# Altium schematic sheet MIDI_CV_converter.SchDoc: MIDI to CV Converter
size Letter; Organization: Nicholas Morrow; Address1: UC Santa Barbara; Address2: Physics 127AL; Address3: Spring 2015; Revision: a
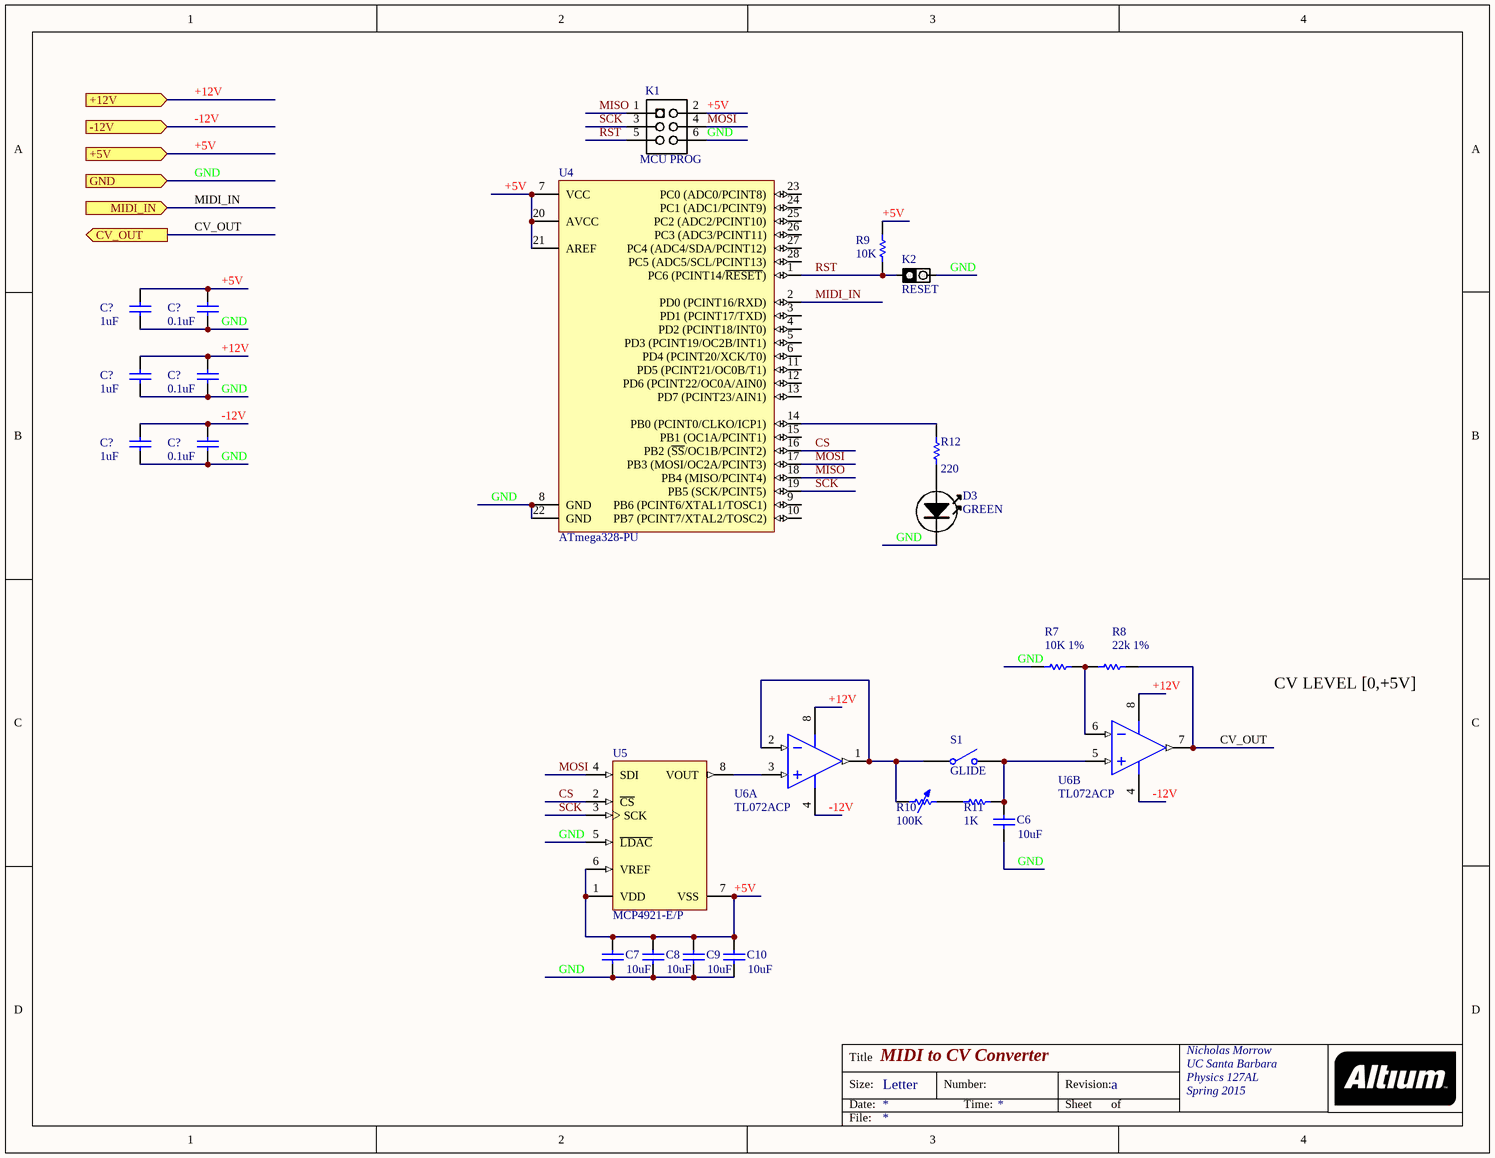
[diagram p0: MIDI_CV_converter.SchDoc]

## Parts
(Parts that share a designator on the sheet are numbered #1, #2 ... from top to bottom, then left to right.)
C6  value 10uF  [RAD-0.3]  (hidden comment: Cap)
C7  value 10uF  [RAD-0.3]  (hidden comment: Cap)
C8  value 10uF  [RAD-0.3]  (hidden comment: Cap)
C9  value 10uF  [RAD-0.3]  (hidden comment: Cap)
C10  value 10uF  [RAD-0.3]  (hidden comment: Cap)
C?#1  value 1uF  [RAD-0.3]  (hidden comment: Cap)
C?#2  value 0.1uF  [RAD-0.3]  (hidden comment: Cap)
C?#3  value 1uF  [RAD-0.3]  (hidden comment: Cap)
C?#4  value 0.1uF  [RAD-0.3]  (hidden comment: Cap)
C?#5  value 1uF  [RAD-0.3]  (hidden comment: Cap)
C?#6  value 0.1uF  [RAD-0.3]  (hidden comment: Cap)
D3  GREEN  [LED-5MM-GREEN]
K1  MCU PROG  [HEADER-2X3]
K2  RESET  [JMPR2]
R7  value 10K 1%  [AXIAL-0.3]
R8  value 22k 1%  [AXIAL-0.3]
R9  value 10K  [AXIAL-0.3]
R10  value 100K  [AXIAL-0.7]  (hidden comment: Res Adj1)
R11  value 1K  [AXIAL-0.3]
R12  value 220  [AXIAL-0.3]
S1  GLIDE  [SPST-2]
U4  ATmega328-PU  [28P3]
U5  MCP4921-E/P  [PDIP300-P8]
U6  TL072ACP  [TI-P8]  (parts A,B of 2)

## Ports
+5V (in), +12V (in), -12V (in), CV_OUT (out), GND (in), MIDI_IN (in)

## Nets
+5V: C7.2 C8.2 C9.2 C10.2 C?#1.2 C?#2.2 K1.2 R9.2 U4.7(VCC) U4.20(AVCC) U4.21(AREF) U5.1(VDD) U5.6(VREF) U5.7(VSS) ; port +5V
+12V: C?#3.2 C?#4.2 U6.8(VCC+) ; port +12V
-12V: C?#5.2 C?#6.2 U6.4(VCC-) ; port -12V
CS: U4.16(PB2_(~{SS}/OC1B/PCINT2)) U5.2(~{CS})
CV_OUT: R8.1 U6.7(OUT2) ; port CV_OUT
GND: C6.1 C7.1 C8.1 C9.1 C10.1 C?#1.1 C?#2.1 C?#3.1 C?#4.1 C?#5.1 C?#6.1 D3.K K1.6 K2.2 R7.2 U4.8(GND) U4.22(GND) U5.5(~{LDAC}) ; port GND
MIDI_IN: U4.2(PD0_(PCINT16/RXD)) ; port MIDI_IN
MISO: K1.1 U4.18(PB4_(MISO/PCINT4))
MOSI: K1.4 U4.17(PB3_(MOSI/OC2A/PCINT3)) U5.4(SDI)
RST: K1.5 K2.1 R9.1 U4.1(PC6_(PCINT14/~{RESET}))
SCK: K1.3 U4.19(PB5_(SCK/PCINT5)) U5.3(SCK)
NetC6_2: C6.2 R11.1 S1.2(NO) U6.5(IN2+)
NetD3_A: D3.A R12.1
NetR7_1: R7.1 R8.2 U6.6(IN2-)
NetR10_1: R10.1 S1.1(COMMON) U6.1(OUT1) U6.2(IN1-)
NetR10_2: R10.2 R11.2
NetR12_2: R12.2 U4.14(PB0_(PCINT0/CLKO/ICP1))
NetU5_8: U5.8(VOUT) U6.3(IN1+)

Not connected (* = marked no-connect by the designer): U4 3(PD1_(PCINT17/TXD)) 4(PD2_(PCINT18/INT0)) 5(PD3_(PCINT19/OC2B/INT1)) 6(PD4_(PCINT20/XCK/T0)) 9(PB6_(PCINT6/XTAL1/TOSC1)) 10(PB7_(PCINT7/XTAL2/TOSC2)) 11(PD5_(PCINT21/OC0B/T1)) 12(PD6_(PCINT22/OC0A/AIN0)) 13(PD7_(PCINT23/AIN1)) 15(PB1_(OC1A/PCINT1)) 23(PC0_(ADC0/PCINT8)) 24(PC1_(ADC1/PCINT9)) 25(PC2_(ADC2/PCINT10)) 26(PC3_(ADC3/PCINT11)) 27(PC4_(ADC4/SDA/PCINT12)) 28(PC5_(ADC5/SCL/PCINT13))

## Notes on the sheet
- CV LEVEL [0,+5V]
- Title
- Size:
- Date:
- Letter
- Number:
- Time:
- Revision:
- Sheet
- of
- File:

## Library data of the parts
C6-C10 C?#1-C?#6 = Cap: Capacitor; Published: 8-Jun-2000; LatestRevisionDate: 17-Jul-2002; LatestRevisionNote: Re-released for DXP Platform.; PackageReference: RAD-0.3; Publisher: Altium Limited; PackageDescription: Radial Cap, Thru-Hole; 2 Leads; 0.3 in Pin Spacing
D3 = LED-GREEN-5MM
K1 = HEADER-2X3
K2 = JMPR2: JMPR2 OPEN BY DEFAULT; Manufacturer: Sullins Connector Solutions; Manufacturer Part Number: PBC36SAAN; Supplier 1: Digi-Key; Supplier Part Number 1: S1011E-36-ND; Reel: Open
R7-R9 R11 R12 = Res1: Resistor; Published: 8-Jun-2000; LatestRevisionDate: 17-Jul-2002; LatestRevisionNote: Re-released for DXP Platform.; PackageReference: AXIAL-0.3; Publisher: Altium Limited; PackageDescription: Axial Device, Thru-Hole; 2 Leads; 0.3 in Pin Spacing
R10 = Res Adj1: Variable Resistor; Set Position: 0.5; Published: 8-Jun-2000; LatestRevisionDate: 17-Jul-2002; LatestRevisionNote: Re-released for DXP Platform.; PackageReference: AXIAL-0.7; Publisher: Altium Limited; PackageDescription: Axial Device, Thru-Hole; 2 Leads; 0.7 in Pin Spacing
S1 = SW-SPST: Single-Pole, Single-Throw Switch; Published: 24-Mar-1999; LatestRevisionDate: 17-Jul-2002; LatestRevisionNote: Re-released for DXP Platform.; PackageReference: SPST-2; Publisher: Altium Limited; PackageDescription: Switch; 2 Leads
U4 = ATmega328-PU: 8-bit AVR Microcontroller, 32KB Flash, 1KB EEPROM, 2KB SRAM, 28-pin PDIP, Industrial Grade (-40°C to 85°C); Published: 1-Apr-2010; DatasheetVersion: revA, Jan-2010; PackageVersion: revB, Sep-2001; PackageReference: 28P3; Publisher: Altium Limited; PackageDescription: 28-lead (0.300"/7.62mm Wide) Plastic Dual Inline Package (PDIP); Supplier 1: Digi-Key; Supplier Part Number 1: ATMEGA328-PU-ND; Supplier 2: Mouser; Supplier Part Number 2: 556-ATMEGA328-PU; ComponentLink1Description: Manufacturer Link; ComponentLink1URL: http://www.atmel.com/products/avr/default.asp?; ComponentLink2Description: ATmega48A/48PA/88A/88PA/168A/168PA/328/328P Datasheet; ComponentLink2URL: http://www.atmel.com/dyn/resources/prod_documents/8271.pdf; ComponentLink3Description: ATmega48A/48PA/88A/88PA/168A/168PA/328/328P Summary; ComponentLink3URL: http://www.atmel.com/dyn/resources/prod_documents/8271S.pdf; ComponentLink4Description: Atmel.com Home; ComponentLink4URL: http://www.atmel.com
U5 = MCP4921-E/P: 12-Bit DAC with SPI Interface, 8-Pin PDIP, Extended Temperature; Manufacturer: Microchip; DatasheetVersion: revA, Apr-2010; PackageVersion: revBB, Aug-2009; PackageReference: PDIP300-P8; PackageDescription: 8-Lead Plastic Dual In-Line (P) - 300 mil Body [PDIP]; Supplier 1: Digi-Key; Supplier Part Number 1: MCP4921-E/P-ND; Supplier 2: Newark; Supplier Part Number 2: 08J8743; Supplier 3: Mouser; Supplier Part Number 3: 579-MCP4921-E/P; Mounting Technology: Through Hole; Code_JEDEC: MS-001; PartNumber: MCP4921-E/P; ComponentLink1Description: Manufacturer URL; ComponentLink1URL: http://www.microchip.com/; ComponentLink2Description: Datasheet; ComponentLink2URL: http://ww1.microchip.com/downloads/en/DeviceDoc/22248a.pdf; ComponentLink3Description: Package Specification; ComponentLink3URL: http://www.microchip.com/stellent/groups/techpub_sg/documents/packagingspec/en012702.pdf
U6 = TL072ACP: Low-Noise JFET-Input Operational Amplifier, 7 to 36 V, 0 to 70 degC, 8-pin DIP (P8), Pb-Free (RoHS); Manufacturer: Texas Instruments; CMRR(Min)(dB): 75; GBW(Typ)(MHz): 3; IIB(Max)(pA): 200; Iq per channel(Max)(mA): 2.5; Number of Channels: 2; Offset Drift(Typ)(uV/C): 18; Rating: Catalog; Slew Rate(Typ)(V/us): 13; Sub Family: General Purpose Amplifier, High Supply Voltage Amplifier (>=30V); Total Supply Voltage(Max)(+5V is 5, +/-5V is 10): 36; Total Supply Voltage(Min)(+5V is 5, +/-5V is 10): 7; Vio (25C)(Max)(mV): 6; DatasheetVersion: SLOS080J; PackageVersion: 4040082/E, 04/2010; PackageReference: P8; PackageDescription: 8-Pin Plastic In-Line, Body 9.59 x 6.35 mm, Pitch 2.54 mm; Supplier 1: Digi-Key; Supplier Part Number 1: 296-7190-5-ND; Supplier 2: Farnell; Supplier Part Number 2: 1103005; Supplier 3: Newark; Supplier Part Number 3: 60K6987; Supplier 4: Mouser; Supplier Part Number 4: 595-TL072ACP; Eco-Plan: Pb-Free (RoHS); Vn at 1kHz(Typ)(nV/rtHz): 18; Mounting Technology: Through Hole; Code_JEDEC: MS-001; PartNumber: TL072ACP; ComponentLink1Description: Manufacturer URL; ComponentLink1URL: http://www.ti.com/; ComponentLink2Description: Datasheet; ComponentLink2URL: http://www.ti.com/lit/ds/symlink/tl072a.pdf; ComponentLink3Description: Package Specification; ComponentLink3URL: http://www.ti.com/litv/pdf/mpdi001b